# EAGLE design PCB_Chasis2 (EAGLE 9.6.2)
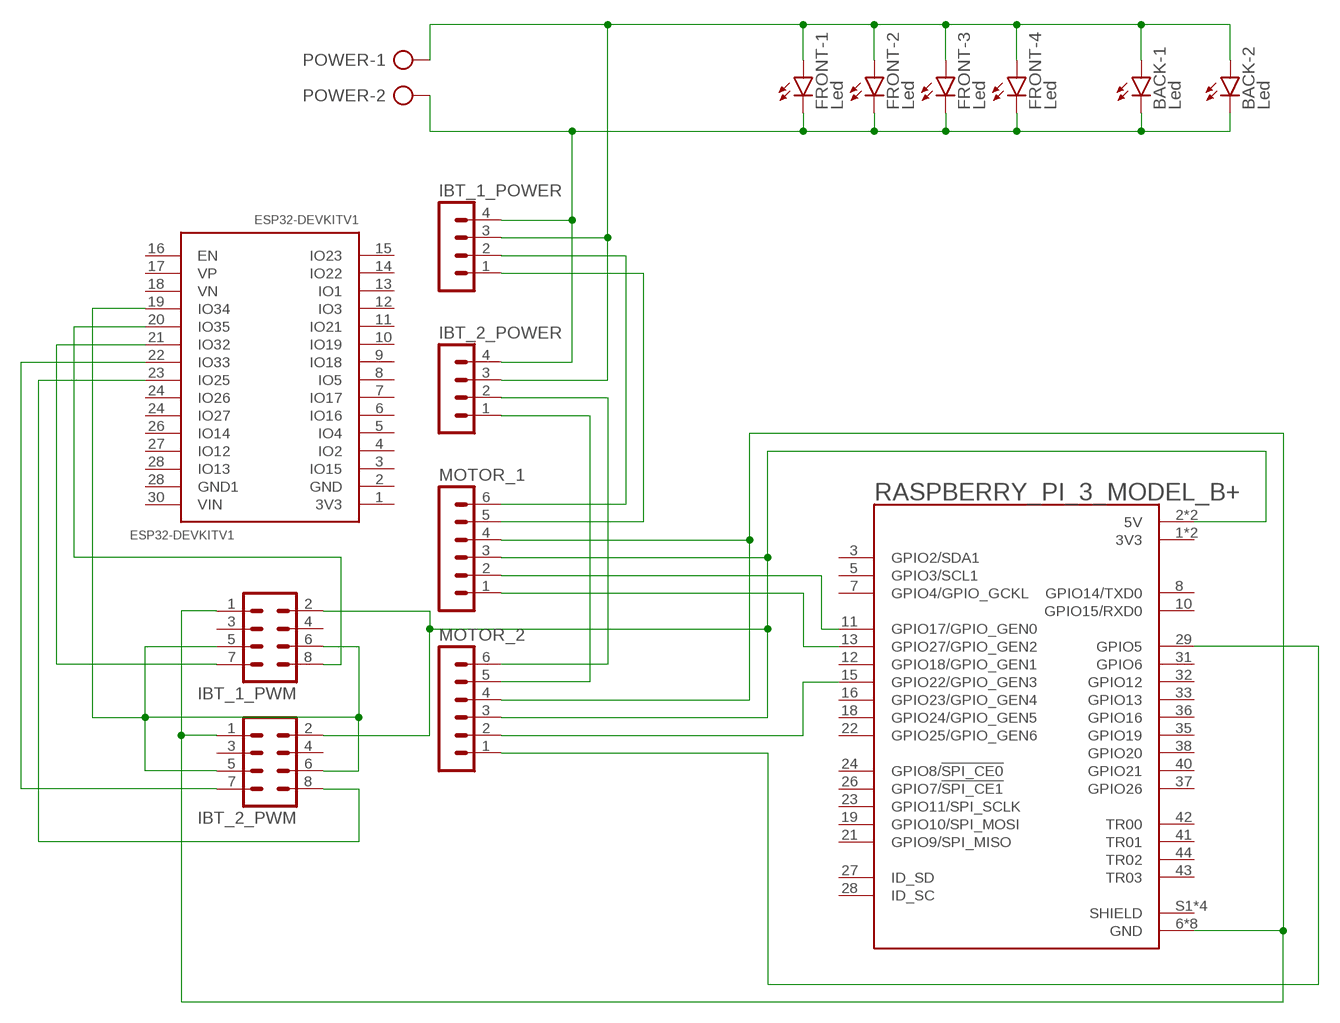
[diagram p0: schematic, sheet 1]

## Parts
BACK  Led  LZR182  [LZR182]
ESP32-DEVKITV1  ESP32DEVKITV1  [ESP32-DEVKITV1]
FRONT  Led  LZR184  [LZR184]
IBT_1_POWER  MA04-1  [MA04-1]
IBT_1_PWM  MA04-2  [MA04-2]
IBT_2_POWER  MA04-1  [MA04-1]
IBT_2_PWM  MA04-2  [MA04-2]
MOTOR_1  MA06-1  [MA06-1]
MOTOR_2  MA06-1  [MA06-1]
POWER  AK500/2-H  [AK500/2-H]
RASPBERRY_PI_3_MODEL_B+  RASPBERRY_PI_3_MODEL_B+  [MODULE_RASPBERRY_PI_3_MODEL_B+]

## Nets
N$1: BACK.A1(-1:A) BACK.A2(-2:A) FRONT.A1(-1:A) FRONT.A2(-2:A) FRONT.A3(-3:A) FRONT.A4(-4:A) IBT_1_POWER.3 IBT_2_POWER.3 POWER.1
N$2: BACK.K1(-1:C) BACK.K2(-2:C) FRONT.K1(-1:C) FRONT.K2(-2:C) FRONT.K3(-3:C) FRONT.K4(-4:C) IBT_1_POWER.4 IBT_2_POWER.4 POWER.2
N$3: IBT_1_POWER.2 MOTOR_1.6
N$4: IBT_1_POWER.1 MOTOR_1.5
N$5: IBT_2_POWER.2 MOTOR_2.6
N$6: IBT_2_POWER.1 MOTOR_2.5
N$7: ESP32-DEVKITV1.19(IO34) IBT_1_PWM.5 IBT_1_PWM.6 IBT_2_PWM.5 IBT_2_PWM.6
N$8: IBT_1_PWM.2 IBT_2_PWM.2 MOTOR_1.3 MOTOR_2.3 RASPBERRY_PI_3_MODEL_B+.2(5V) RASPBERRY_PI_3_MODEL_B+.4(5V)
N$9: MOTOR_1.2 RASPBERRY_PI_3_MODEL_B+.11(GPIO17/GPIO_GEN0)
N$10: MOTOR_1.1 RASPBERRY_PI_3_MODEL_B+.13(GPIO27/GPIO_GEN2)
N$11: MOTOR_2.2 RASPBERRY_PI_3_MODEL_B+.15(GPIO22/GPIO_GEN3)
N$12: MOTOR_2.1 RASPBERRY_PI_3_MODEL_B+.29(GPIO5)
N$14: IBT_1_PWM.1 IBT_2_PWM.1 MOTOR_1.4 MOTOR_2.4 RASPBERRY_PI_3_MODEL_B+.6(GND) RASPBERRY_PI_3_MODEL_B+.9(GND) RASPBERRY_PI_3_MODEL_B+.14(GND) RASPBERRY_PI_3_MODEL_B+.20(GND) RASPBERRY_PI_3_MODEL_B+.25(GND) RASPBERRY_PI_3_MODEL_B+.30(GND) RASPBERRY_PI_3_MODEL_B+.34(GND) RASPBERRY_PI_3_MODEL_B+.39(GND)
N$16: ESP32-DEVKITV1.20(IO35) IBT_1_PWM.8
N$17: ESP32-DEVKITV1.21(IO32) IBT_1_PWM.7
N$18: ESP32-DEVKITV1.22(IO33) IBT_2_PWM.7
N$19: ESP32-DEVKITV1.23(IO25) IBT_2_PWM.8
Unconnected: ESP32-DEVKITV1.1(3V3) ESP32-DEVKITV1.2(GND) ESP32-DEVKITV1.3(IO15) ESP32-DEVKITV1.4(IO2) ESP32-DEVKITV1.5(IO4) ESP32-DEVKITV1.6(IO16) ESP32-DEVKITV1.7(IO17) ESP32-DEVKITV1.8(IO5) ESP32-DEVKITV1.9(IO18) ESP32-DEVKITV1.10(IO19) ESP32-DEVKITV1.11(IO21) ESP32-DEVKITV1.12(IO3) ESP32-DEVKITV1.13(IO1) ESP32-DEVKITV1.14(IO22) ESP32-DEVKITV1.15(IO23) ESP32-DEVKITV1.16(EN) ESP32-DEVKITV1.17(VP) ESP32-DEVKITV1.18(VN) ESP32-DEVKITV1.24(IO26) ESP32-DEVKITV1.24(IO27) ESP32-DEVKITV1.26(IO14) ESP32-DEVKITV1.27(IO12) ESP32-DEVKITV1.28(GND1) ESP32-DEVKITV1.28(IO13) ESP32-DEVKITV1.30(VIN) IBT_1_PWM.3 IBT_1_PWM.4 IBT_2_PWM.3 IBT_2_PWM.4 RASPBERRY_PI_3_MODEL_B+.3(GPIO2/SDA1) RASPBERRY_PI_3_MODEL_B+.5(GPIO3/SCL1) RASPBERRY_PI_3_MODEL_B+.7(GPIO4/GPIO_GCKL) RASPBERRY_PI_3_MODEL_B+.8(GPIO14/TXD0) RASPBERRY_PI_3_MODEL_B+.10(GPIO15/RXD0) RASPBERRY_PI_3_MODEL_B+.12(GPIO18/GPIO_GEN1) RASPBERRY_PI_3_MODEL_B+.16(GPIO23/GPIO_GEN4) RASPBERRY_PI_3_MODEL_B+.18(GPIO24/GPIO_GEN5) RASPBERRY_PI_3_MODEL_B+.19(GPIO10/SPI_MOSI) RASPBERRY_PI_3_MODEL_B+.21(GPIO9/SPI_MISO) RASPBERRY_PI_3_MODEL_B+.22(GPIO25/GPIO_GEN6) RASPBERRY_PI_3_MODEL_B+.23(GPIO11/SPI_SCLK) RASPBERRY_PI_3_MODEL_B+.24(GPIO8/!SPI_CE0!) RASPBERRY_PI_3_MODEL_B+.26(GPIO7/!SPI_CE1!) RASPBERRY_PI_3_MODEL_B+.27(ID_SD) RASPBERRY_PI_3_MODEL_B+.28(ID_SC) RASPBERRY_PI_3_MODEL_B+.31(GPIO6) RASPBERRY_PI_3_MODEL_B+.32(GPIO12) RASPBERRY_PI_3_MODEL_B+.33(GPIO13) RASPBERRY_PI_3_MODEL_B+.35(GPIO19) RASPBERRY_PI_3_MODEL_B+.36(GPIO16) RASPBERRY_PI_3_MODEL_B+.37(GPIO26) RASPBERRY_PI_3_MODEL_B+.38(GPIO20) RASPBERRY_PI_3_MODEL_B+.40(GPIO21) RASPBERRY_PI_3_MODEL_B+.41(TR01) RASPBERRY_PI_3_MODEL_B+.42(TR00) RASPBERRY_PI_3_MODEL_B+.43(TR03) RASPBERRY_PI_3_MODEL_B+.44(TR02)

## Power pins joined to a net without a drawn wire
3V3: RASPBERRY_PI_3_MODEL_B+.1(3V3) RASPBERRY_PI_3_MODEL_B+.17(3V3)
SHIELD: RASPBERRY_PI_3_MODEL_B+.S1(SHIELD) RASPBERRY_PI_3_MODEL_B+.S2(SHIELD) RASPBERRY_PI_3_MODEL_B+.S3(SHIELD) RASPBERRY_PI_3_MODEL_B+.S4(SHIELD)

## Library data of the parts
BACK = led:LZR182: LED BLOCK 2 LEDs, Siemens
ESP32-DEVKITV1 = ESP32-DEVKITV1:ESP32DEVKITV1
FRONT = led:LZR184: LED BLOCK 4 LEDs, Siemens
IBT_1_POWER IBT_2_POWER = con-lstb:MA04-1: PIN HEADER; OC_FARNELL: unknown; OC_NEWARK: unknown
IBT_1_PWM IBT_2_PWM = con-lstb:MA04-2: PIN HEADER; OC_FARNELL: unknown; OC_NEWARK: unknown
MOTOR_1 MOTOR_2 = con-lstb:MA06-1: PIN HEADER; OC_FARNELL: unknown; OC_NEWARK: unknown
POWER = con-ptr500:AK500/2-H: CONNECTOR Aug. 2004 / PTR Meßtechnik: Die Bezeichnung der Serie AK505 wurde geändert. Es handelt sich hierbei um AK500 in horizontaler Ausführung.; OC_FARNELL: unknown; OC_NEWARK: unknown
RASPBERRY_PI_3_MODEL_B+ = RASPBERRY_PI_3_MODEL_B_:RASPBERRY_PI_3_MODEL_B+: Check availability <https://pricing.snapeda.com/parts/RASPBERRY%20PI%203%20MODEL%20B%2B/Raspberry%20Pi/view-part?ref=eda>; AVAILABILITY: Not in stock; CHECK_PRICES: https://www.snapeda.com/parts/RASPBERRY%20PI%203%20MODEL%20B+/Raspberry+Pi/view-part/?ref=eda; DESCRIPTION: Single Board Computer, Model B+ 1GB RAM,Raspberry Pi 3 Series | Raspberry Pi RASPBERRY PI 3 MODEL B+; MF: Raspberry Pi; MP: RASPBERRY PI 3 MODEL B+; PACKAGE: Raspberry Pi; PRICE: None; SNAPEDA_LINK: https://www.snapeda.com/parts/RASPBERRY%20PI%203%20MODEL%20B+/Raspberry+Pi/view-part/?ref=snap

## Board
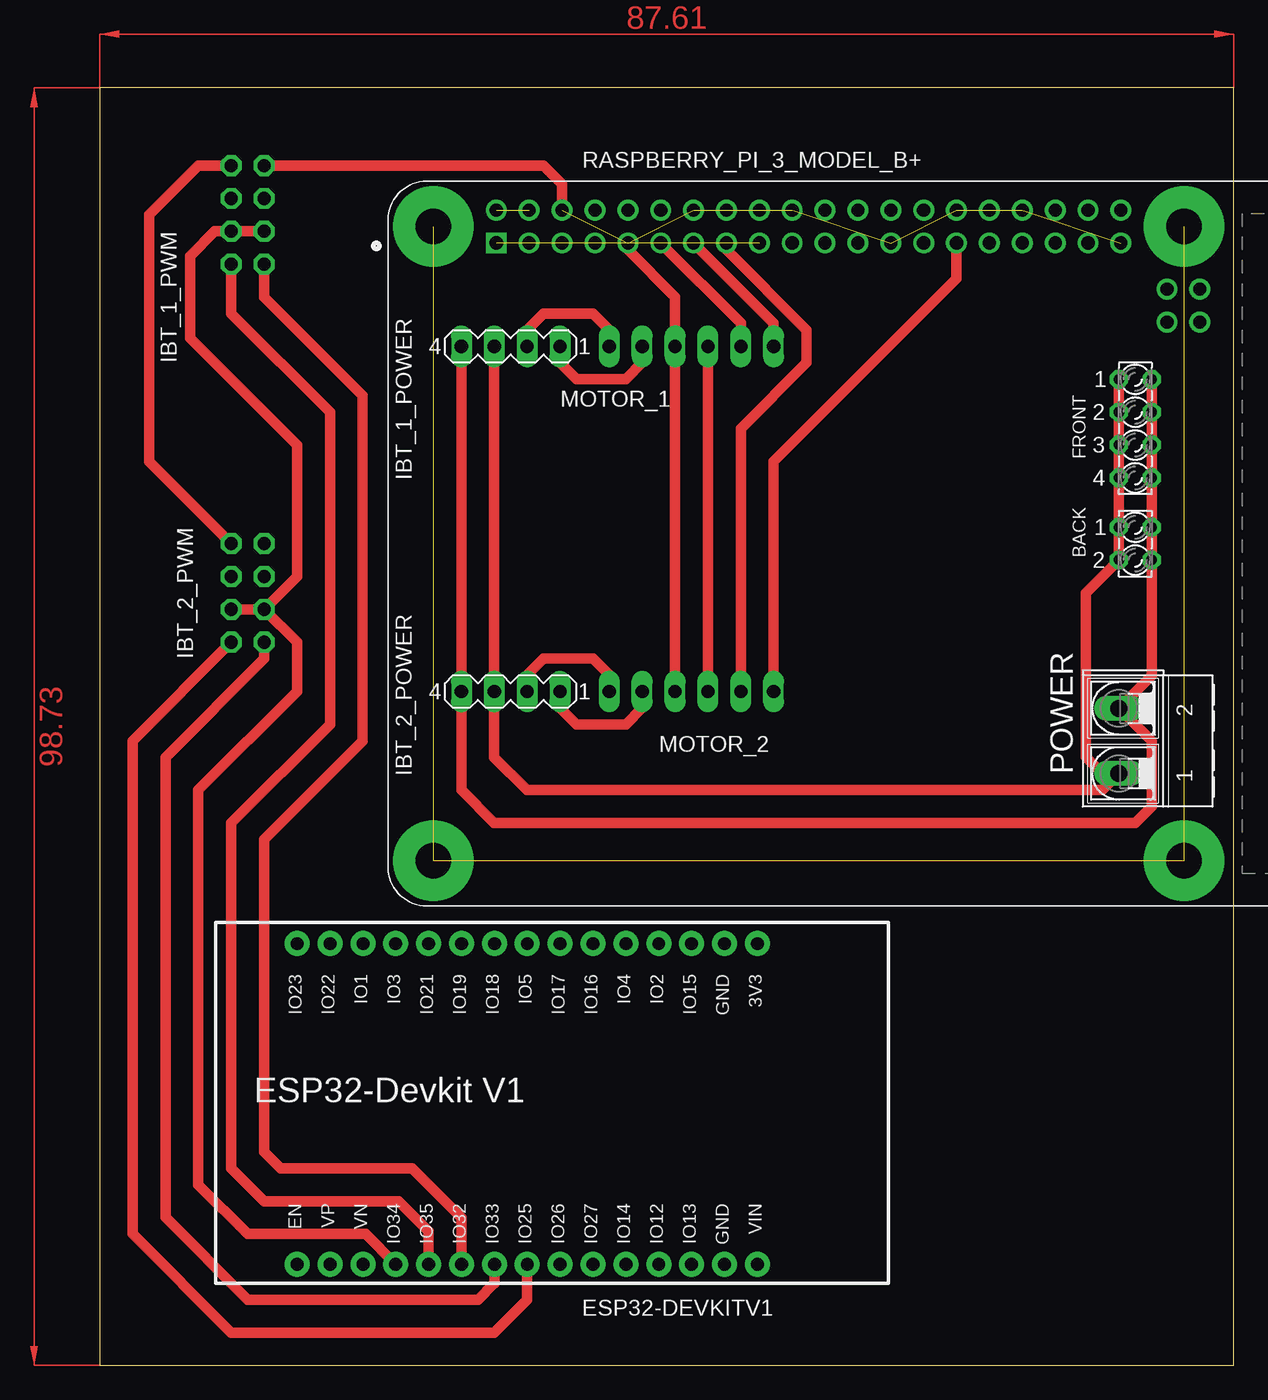
[diagram p1: board, top side]
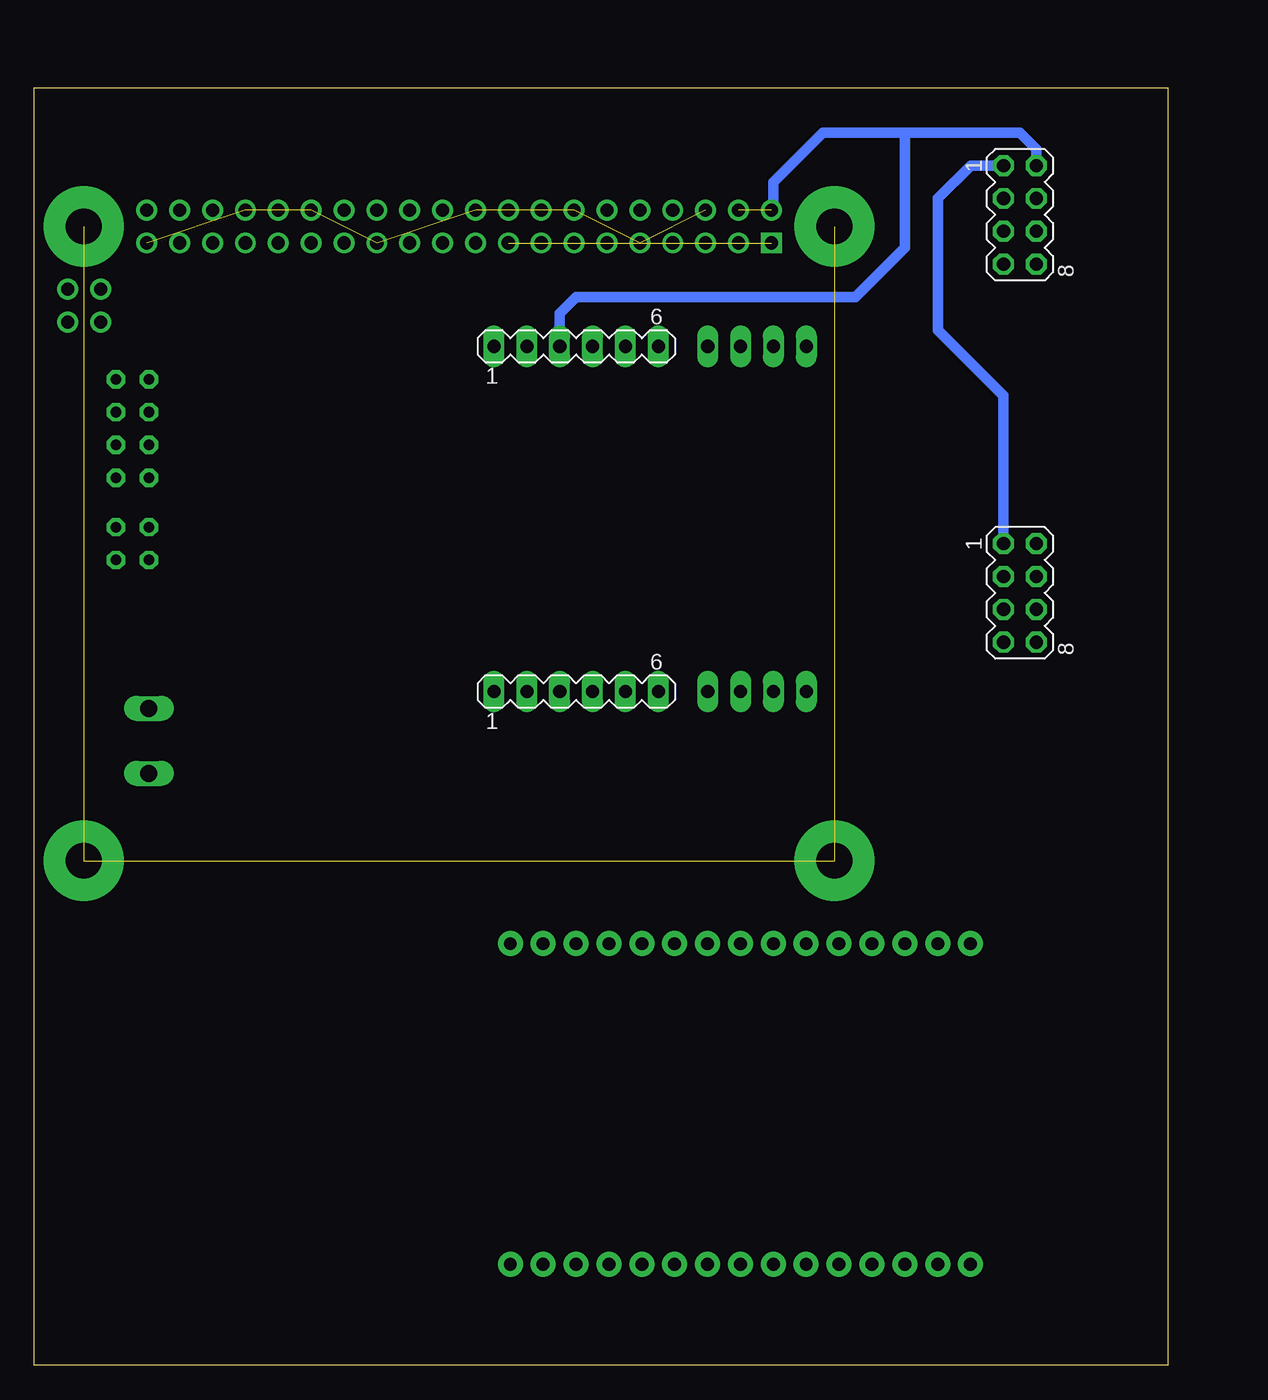
[diagram p2: board, bottom side, seen from below]

Size 87.61 x 98.73 mm. Coordinates in mm from the lower left corner, seen from the top.
Outline: 0,0 87.61,0 87.61,98.73 0,98.73 0,0
Copper layers (1*16): Top 0.035mm / dielectric 1.5mm / Bottom 0.035mm
Design rules "China_JLCPCB *": minimum track width 0.25mm, minimum drill 0.5mm, track to track 0.24mm, track to pad 0.23mm, pad to pad 0.2mm, via to via 0.25mm, smd to smd 0.2mm, copper to edge 0.5mm, drill to drill 0.3mm, minimum pad ring 0.3mm, minimum via ring 0.3mm, stop-mask expansion 3mil, vias tented up to drill 0.6mm, thermal gap 20mil

### Footprints (pad centres in the part's own frame; a part is rotated, then mirrored left to right if it is on the bottom)
LZR182 = drill 0.813 octagon: A1 -1.27,1.27; A2 -1.27,-1.27; K1 1.27,1.27; K2 1.27,-1.27
ESP32-DEVKITV1 = drill 1 pad 1.93: 1 -22.87,-13.54; 2 -20.33,-13.54; 3 -17.79,-13.54; 4 -15.25,-13.54; 5 -12.71,-13.54; 6 -10.17,-13.54; 7 -7.63,-13.54; 8 -5.09,-13.54; 9 -2.55,-13.54; 10 -0.01,-13.54; 11 2.53,-13.54; 12 5.07,-13.54; 13 7.61,-13.54; 14 10.15,-13.54; 15 12.69,-13.54; 16 12.69,11.23; 17 10.15,11.23; 18 7.61,11.23; 19 5.07,11.23; 20 2.53,11.23; 21 -0.01,11.23; 22 -2.55,11.23; 23 -5.09,11.23; 24 -7.63,11.23; 25 -10.17,11.23; 26 -12.71,11.23; 27 -15.25,11.23; 28 -17.79,11.23; 29 -20.33,11.23; 30 -22.87,11.23
LZR184 = drill 0.813 octagon: A1 -1.27,3.81; A2 -1.27,1.27; A3 -1.27,-1.27; A4 -1.27,-3.81; K1 1.27,3.81; K2 1.27,1.27; K3 1.27,-1.27; K4 1.27,-3.81
MA04-1 = drill 1.016 long: 1 -3.81,0; 2 -1.27,0; 3 1.27,0; 4 3.81,0
MA04-2 = drill 1.016 octagon: 1 -3.81,-1.27; 2 -3.81,1.27; 3 -1.27,-1.27; 4 -1.27,1.27; 5 1.27,-1.27; 6 1.27,1.27; 7 3.81,-1.27; 8 3.81,1.27
MA06-1 = drill 1.016 long: 1 -6.35,0; 2 -3.81,0; 3 -1.27,0; 4 1.27,0; 5 3.81,0; 6 6.35,0
AK500/2-H = drill 1.321 long: 1 -2.515,0; 2 2.515,0
MODULE_RASPBERRY_PI_3_MODEL_B+ = drill 1.016 square: 1 -34.13,23.23 | drill 1.016: 2 -34.13,25.77; 3 -31.59,23.23; 4 -31.59,25.77; 5 -29.05,23.23; 6 -29.05,25.77; 7 -26.51,23.23; 8 -26.51,25.77; 9 -23.97,23.23; 10 -23.97,25.77; 11 -21.43,23.23; 12 -21.43,25.77; 13 -18.89,23.23; 14 -18.89,25.77; 15 -16.35,23.23; 16 -16.35,25.77; 17 -13.81,23.23; 18 -13.81,25.77; 19 -11.27,23.23; 20 -11.27,25.77; 21 -8.73,23.23; 22 -8.73,25.77; 23 -6.19,23.23; 24 -6.19,25.77; 25 -3.65,23.23; 26 -3.65,25.77; 27 -1.11,23.23; 28 -1.11,25.77; 29 1.43,23.23; 30 1.43,25.77; 31 3.97,23.23; 32 3.97,25.77; 33 6.51,23.23; 34 6.51,25.77; 35 9.05,23.23; 36 9.05,25.77; 37 11.59,23.23; 38 11.59,25.77; 39 14.13,23.23; 40 14.13,25.77; 41 20.23,17.107; 42 20.23,19.647; 43 17.69,17.107; 44 17.69,19.647 | drill 2.75 pad 6.2: S1 -39,24.5; S2 19,24.5; S3 19,-24.5; S4 -39,-24.5

### Placement (x,y rotation side)
BACK  80.01,63.5 0 top
ESP32-DEVKITV1  27.94,19.05 180 top
FRONT  80.01,72.39 0 top
IBT_1_POWER  31.75,78.74 180 top
IBT_1_PWM  11.43,88.9 270 bottom
IBT_2_POWER  31.75,52.07 180 top
IBT_2_PWM  11.43,59.69 270 bottom
MOTOR_1  45.72,78.74 0 bottom
MOTOR_2  45.72,52.07 0 bottom
POWER  78.74,48.26 90 top
RASPBERRY_PI_3_MODEL_B+  64.77,63.5 0 top

### Tracks (layer width: path | path; a pad name or v marks a point on that pad's centre or on a via)
3V3  (1 unrouted)
N$1
  Top 0.25: 78.73,45.73 POWER.1
  Top 0.813: 78.73,45.73 77.45,44.45 33.02,44.45 30.48,46.99 IBT_2_POWER.3 IBT_1_POWER.3 | POWER.1 77.45,45.74 76.18,47.01 76.18,59.67 BACK.A2 BACK.A1 FRONT.A4 FRONT.A3 FRONT.A2 FRONT.A1
N$2
  Top 0.813: IBT_1_POWER.4 IBT_2_POWER.4 27.94,44.45 30.48,41.91 80.01,41.91 81.3,43.2 81.3,48.24 78.77,50.77 POWER.2 81.28,53.31 BACK.K2 BACK.K1 FRONT.K4 FRONT.K3 FRONT.K2 FRONT.K1
N$3
  Top 0.813: IBT_1_POWER.2 33.02,80.01 34.29,81.28 38.1,81.28 39.37,80.01 MOTOR_1.6
N$4
  Top 0.813: MOTOR_1.5 41.91,77.47 40.64,76.2 36.83,76.2 35.56,77.47 IBT_1_POWER.1
N$5
  Top 0.813: IBT_2_POWER.2 33.02,53.34 34.29,54.61 38.1,54.61 39.37,53.34 MOTOR_2.6
N$6
  Top 0.813: IBT_2_POWER.1 35.56,50.8 36.83,49.53 40.64,49.53 41.91,50.8 MOTOR_2.5
N$7
  Top 0.813: IBT_2_PWM.6 IBT_2_PWM.5 | IBT_2_PWM.5 15.24,60.96 15.24,71.12 6.98,79.38 6.98,85.72 8.89,87.63 IBT_1_PWM.6 IBT_1_PWM.5 | ESP32-DEVKITV1.19 20.53,10.16 11.43,10.16 7.62,13.97 7.62,44.45 15.24,52.07 15.24,55.88 IBT_2_PWM.5
N$8  (1 unrouted)
  Top 0.813: IBT_1_PWM.2 7.62,92.71 3.81,88.9 3.81,69.85 IBT_2_PWM.2 | MOTOR_1.3 MOTOR_2.3
  Bottom 0.813: RASPBERRY_PI_3_MODEL_B+.2 30.48,89.43 30.48,91.44 26.67,95.25 20.32,95.25 | IBT_1_PWM.2 10.16,93.98 11.43,95.25 20.32,95.25 | MOTOR_1.3 46.99,81.28 45.72,82.55 24.13,82.55 20.32,86.36 20.32,95.25
N$9
  Top 0.813: RASPBERRY_PI_3_MODEL_B+.11 49.53,80.54 MOTOR_1.2
N$10
  Top 0.813: RASPBERRY_PI_3_MODEL_B+.13 52.07,80.54 MOTOR_1.1
N$11
  Top 0.813: MOTOR_2.2 49.53,72.39 54.61,77.47 54.61,80.01 48.42,86.2 RASPBERRY_PI_3_MODEL_B+.15
N$12
  Top 0.813: MOTOR_2.1 52.07,69.85 66.2,83.98 RASPBERRY_PI_3_MODEL_B+.29
N$14  (7 unrouted)
  Top 0.813: RASPBERRY_PI_3_MODEL_B+.6 35.72,91.28 34.29,92.71 IBT_1_PWM.1 | MOTOR_2.4 MOTOR_1.4 44.45,82.55 40.8,86.2 RASPBERRY_PI_3_MODEL_B+.9
  Bottom 0.813: IBT_1_PWM.1 15.24,92.71 17.78,90.17 17.78,80.01 12.7,74.93 IBT_2_PWM.1
N$16
  Top 0.813: IBT_1_PWM.8 10.16,81.28 17.78,73.66 17.78,49.53 10.16,41.91 10.16,15.24 12.7,12.7 23.07,12.7 25.41,10.36 ESP32-DEVKITV1.20
N$17
  Top 0.813: IBT_1_PWM.7 12.7,82.55 20.32,74.93 20.32,48.26 12.7,40.64 12.7,16.51 13.97,15.24 24.13,15.24 27.95,11.42 ESP32-DEVKITV1.21
N$18
  Top 0.25: 30.48,6.35 30.49,6.36 | 30.49,7.62 ESP32-DEVKITV1.22
  Top 0.813: IBT_2_PWM.7 12.7,54.61 5.08,46.99 5.08,11.43 11.43,5.08 29.21,5.08 30.48,6.35 | 30.49,6.36 30.49,7.62
N$19
  Top 0.813: ESP32-DEVKITV1.23 33.03,5.09 30.48,2.54 10.16,2.54 2.54,10.16 2.54,48.26 IBT_2_PWM.8
SHIELD  (3 unrouted)
(copper drawn outside any net)
  shapes: Top area x2